# Altium schematic sheet Power_Internal.SchDoc
size A4; SheetNumber: 6
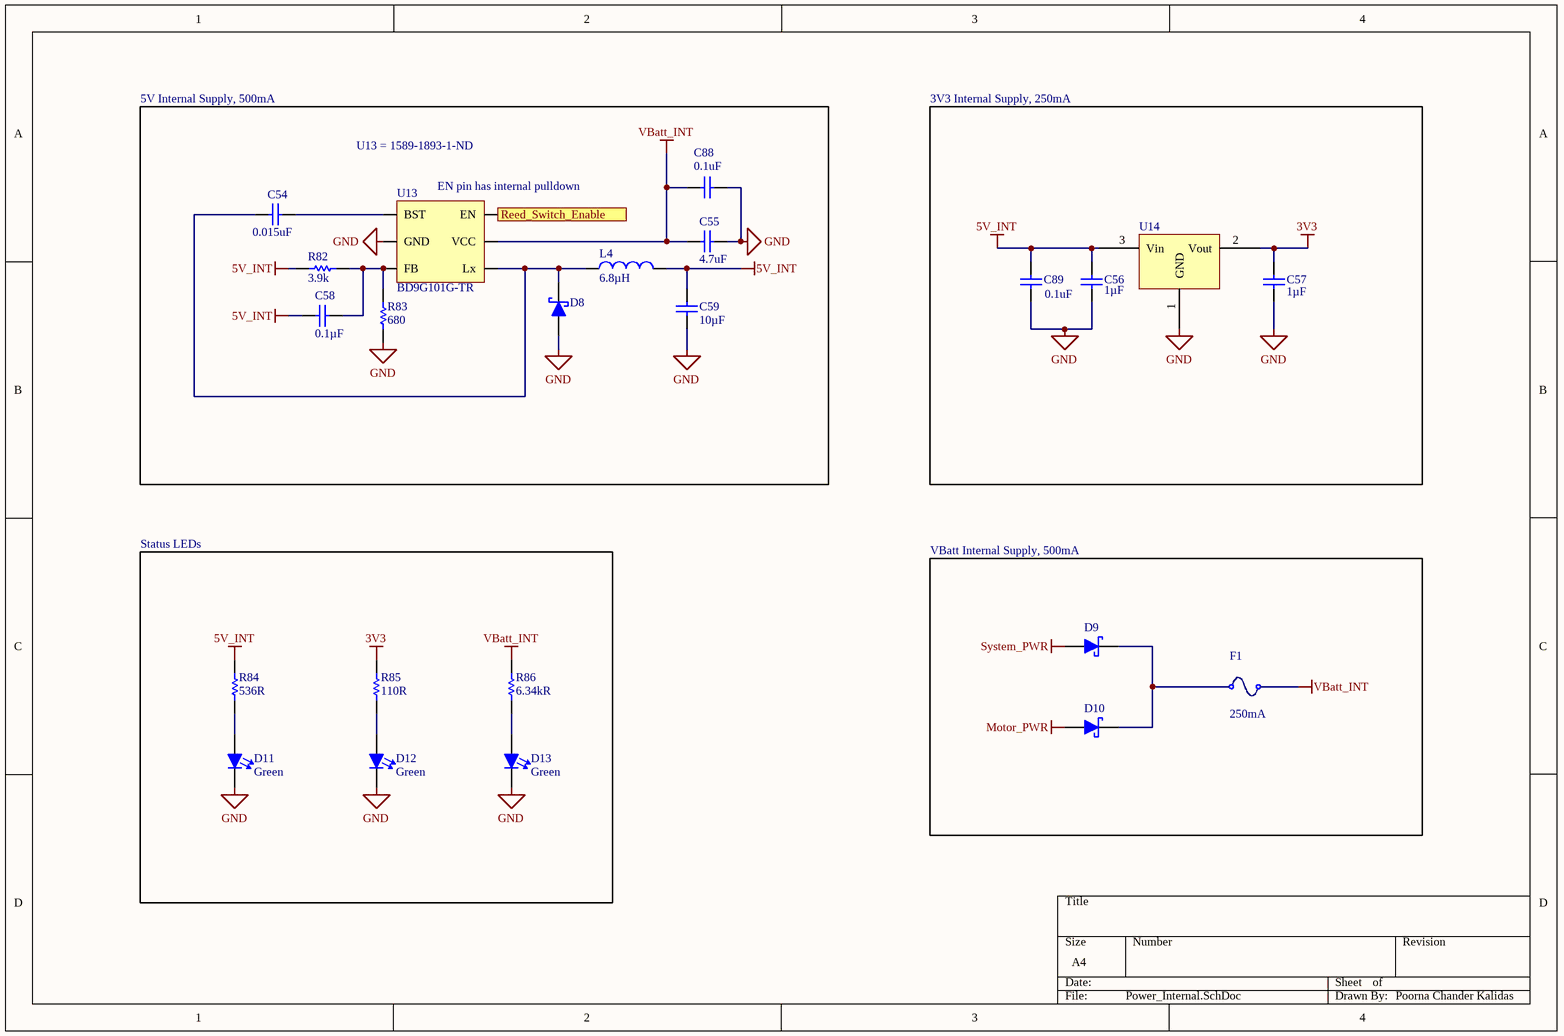
[diagram p0: Power_Internal.SchDoc]

## Parts
C54  value 0.015uF  [CAPC1608N(0603")]  (hidden comment: 0.015uF 50V 0603 SMD, Ceramic)
C55  value 4.7uF  [CAPC3216N(1206")]  (hidden comment: 4.7uF 50V 1206 SMD, Ceramic)
C56  value 1µF  [CAPC1608N(0603")]  (hidden comment: 1uF 25V 0603 SMD, Ceramic)
C57  value 1µF  [CAPC1608N(0603")]  (hidden comment: 1uF 25V 0603 SMD, Ceramic)
C58  Capacitance: 0.1µF  [CAPC1608N(0603")]  (hidden comment: 0.1uF, 50V, 10%, X7R, 1608)
C59  value 10µF  [CAPC2012N(0805")]  (hidden comment: 10uF 10V 0805 SMD, Ceramic)
C88  Capacitance: 0.1uF  [FP-CL10-0_1-IPC_A]  (hidden comment: CL10B104JB8NNNC)
C89  Capacitance: 0.1uF  [FP-CL10-0_1-IPC_A]  (hidden comment: CL10B104JB8NNNC)
D8  RB060M-60TR  [SOD-123]  (value not drawn)
D9  DSS14UTR  [SOD-123F]  (value not drawn)
D10  DSS14UTR  [SOD-123F]  (value not drawn)
D11  Color: Green  [FP-LB_Q39E-MFG]  (hidden comment: LT Q39G-Q1OO-25-1)
D12  Color: Green  [FP-LB_Q39E-MFG]  (hidden comment: LT Q39G-Q1OO-25-1)
D13  Color: Green  [FP-LB_Q39E-MFG]  (hidden comment: LT Q39G-Q1OO-25-1)
F1  Current: 250mA  [1206 SMD]  (hidden comment: SMD Fuse, 250mA, 63V, 1206)
L4  value 6.8µH  [NR4018T6R8M Inductor]  (hidden comment: NR4018T6R8M)
R82  value 3.9k  [RESC2012N(0805")]  (hidden comment: 3.9k, 5%, 1/8W, 0805 SMD)
R83  value 680  [RESC2012N(0805")]  (hidden comment: 680, 5%, 1/8W, 0805 SMD)
R84  Resistance: 536R  [RESC1608X55X30ML15T15]  (hidden comment: ERJ-3EKF5360V)
R85  Resistance: 110R  [RESC1608X55X25ML10T15]  (hidden comment: RC0603FR-07110RL)
R86  Resistance: 6.34kR  [RESC1609X50X30ML10T20]  (hidden comment: CRCW06036K34FKEA)
U13  BD9G101G-TR  [SOT23-6_N]
U14  3.3V 250mA Linear Reg LDO  [SOT95P245X110-3N]  (value not drawn)

## Blocks framed on the sheet
3V3 Internal Supply, 250mA: C56 C57 C89 U14
Status LEDs: D11-D13 R84-R86
VBatt Internal Supply, 500mA: D9 D10 F1

## Ports
Reed_Switch_Enable (in)

## Nets
3V3: C57.2(Cathode) R85.2 U14.2(Vout)
5V_INT: C56.2(Cathode) C58.1(Anode) C59.2(Cathode) C89.1 L4.2 R82.1 R84.1 U14.3(Vin)
GND: C55.1 C56.1(Anode) C57.1(Anode) C59.1(Anode) C88.2 C89.2 D8.A(Anode) D11.1(Cathode) D12.1(Cathode) D13.1(Cathode) R83.1 U13.2(GND) U14.1(GND)
Motor_PWR: D10.A(Anode)
System_PWR: D9.A(Anode)
VBatt_INT: C55.2 C88.1 F1.1 R86.2 U13.5(VCC)
Reed_Switch_Enable: U13.4(EN) ; port Reed_Switch_Enable
NetC54_1: C54.1 D8.K(Cathode) L4.1 U13.6(Lx)
NetC54_2: C54.2 U13.1(BST)
NetC58_2: C58.2(Cathode) R82.2 R83.2 U13.3(FB)
NetD9_K: D9.K(Cathode) D10.K(Cathode) F1.2
NetD11_2: D11.2(Anode) R84.2
NetD12_2: D12.2(Anode) R85.1
NetD13_2: D13.2(Anode) R86.1

## Notes on the sheet
- 5V Internal Supply, 500mA
- U13 = 1589-1893-1-ND
- (near U13) EN pin has internal pulldown
- Poorna Chander Kalidas

## Library data of the parts
C54 = CMP-006-0000-3: Capacitor, Ceramic, 50V, +/-10%, 0603 SMD, X7R; Created By: Lyden Smith; Created On: 2017-06-04; Design Item ID: 0.015uF 50V 0603 SMD, Ceramic; Component Type: Standard; Source: AUVic_Schematic_Library_Capacitors.SchLib; Pin Count: 2
C55 = CMP-006-0045-3: Capacitor, Ceramic, 50V, +/- 10%, 1206 SMD, X7R; Created By: Lyden Smith; Created On: 2017-06-04; Component Type: Standard; Pin Count: 2; Design Item ID: 4.7uF 50V 1206 SMD, Ceramic; Source: AUVic_Schematic_Library_Capacitors.SchLib
C56 C57 = CMP-006-0027-1: Capacitor, Ceramic, 25V, +/- 10%, 0603 SMD, X5R; MFG: Murata-Electronics-North-America; MFG#: GRM188R61E105KA12D; Created By: Andy Bates; Publisher: AUVic; Source: AUVic_Schematic_Library_Capacitors.SchLib; Component Type: Standard; Pin Count: 2; PackageDescription: Chip Capacitor; Design Item ID: 1uF 25V 0603 SMD, Ceramic; Published: 16-06-27
C58 = CMP-006-0008-1: CAP CER 0.1UF 50V 10% X7R 1608 (0603); Manufacturer: Samsung Electro-Mechanics America, Inc; Manufacturer Part Number: CL10B104KB8SFNC; RoHS: RoHS Compliant; Category: Capacitors; Stock 1: 743572; Pricing 1: 1=0.12, 10=0.033, 25=0.0232, 100=0.0152, 500=0.01064, 1000=0.00829 (CAD); Packaging: Cut Tape (CT); Tolerance: ±10%; Voltage - Rated: 50V; Temperature Coefficient: X7R; Mounting Type: Surface Mount, MLCC; Operating Temperature: -55°C ~ 125°C; Applications: Boardflex Sensitive; Ratings: -; Package / Case: 0603 (1608 Metric); Size / Dimension: 0.063" L x 0.031" W (1.60mm x 0.80mm); Height - Seated (Max): -; Thickness (Max): 0.035" (0.90mm); Lead Spacing: -; Features: Soft Termination; Lead Style: -; ComponentLink1URL: http://www.samsungsem.com/servlet/FileDownload?type=spec&file=CL10B104KB8SFNC.pdf; ComponentLink1Description: http://www.samsungsem.com/servlet/FileDownload?type=spec&file=CL10B104KB8SFNC.pdf; Design Item ID: 0.1uF, 50V, 10%, X7R, 1608; Component Type: Standard; Source: AUVic_Schematic_Library_Capacitors.SchLib; Pin Count: 2
C59 = CMP-006-0017-1: Capacitor, Ceramic, 10V, +/- 10%, 0805 SMD, X5R; Made By: Andy Bates; Published: 14-06-23; Publisher: AUVic; PackageDescription: Chip Capacitor; Source: AUVic_Schematic_Library_Capacitors.SchLib; Pin Count: 2; Design Item ID: 10uF 10V 0805 SMD, Ceramic; Component Type: Standard
C88 C89 = CMP-00000-4: CAP CER 0.1UF 50V X7R 0603; Material: Ceramic; Tolerance: 5%; Dielectric: X7R; Width: 0.031inch; Min Operating Temperature: -55°C; Contact Plating: Tin; Length: 1.6mm; Case/Package: 0603; Package Quantity: 1; Voltage Rating: 50V; Voltage: 50V; Radiation Hardening: No; Packaging: Tape and Reel; Max Operating Temperature: 125°C; Case Code (Imperial): 0603; Thickness: 0.035inch; Case Code (Metric): 1608; Height: 0.8mm; Mount: Surface Mount; Depth: 0.8mm
D8 = CMP-057-0013-1: Diode, Schottky, 60V, 2A; Created By: Lyden Smith; Date Created: 2017-06-02; Component Type: Standard; Design Item ID: RB060M-60TR; Pin Count: 2; Source: AUVic_Schematic_Library_Diodes.SchLib
D9 D10 = CMP-057-0003-1: Diode, Schottky, 40V, 1A; Source: AUVic_Schematic_Library_Diodes.SchLib; Date Created: 2018-07-11; Component Type: Standard; Design Item ID: DSS14UTR; ComponentLink1Description: Digikey; Pin Count: 2; Created By: Robert Keen; ComponentLink1URL: https://www.digikey.ca/product-detail/en/smc-diode-solutions/DSS14UTR/1655-1927-1-ND/8341869; Publisher: AUVic
D11-D13 = CMP-00064-3: LED GREEN DIFFUSED 0603 SMD; Dominant Wavelength: 530nm; Luminous Intensity: 280mcd; Lens Style: Diffused,Colorless,Rectangular; Number of LEDs: 1; Forward Voltage: 2.85V; Test Current: 5mA; Reverse Voltage: 5V; Forward Current: 15mA; Luminous Flux: 0.55lm; Radiation Hardening: No; Packaging: Tape and Reel; Mount: Surface Mount; Max Operating Temperature: 85°C; Number of Elements: 1; Number of Pins: 2; Min Operating Temperature: -40°C; Depth: 0.9mm; Case/Package: SMD/SMT; Length: 1.7mm
F1 = CMP-027-0003-1: Source: AUVic_Integrated_Library_Fuses.SchLib; Type: SMD; Date Created: 2018-02-05; Component Type: Standard; Created By: Lyden Smith; Design Item ID: SMD Fuse, 250mA, 63V, 1206; Pin Count: 2
L4 = CMP-029-0008-1: 6.8uH 1.06A; Created By: Lyden Smith; Created On: 2017-06-02; Pin Count: 2; Design Item ID: NR4018T6R8M; Component Type: Standard; Source: AUVic_Integrated_Library_Inductors.SchLib
R82 = CMP-047-0041-1: Created By: Lyden Smith; Created On: 2017-06-04; Pin Count: 2; Design Item ID: 3.9k, 5%, 1/8W, 0805 SMD; Component Type: Standard; Source: AUVic_Schematic_Library_Resistors.SchLib
R83 = CMP-047-0063-1: Created By: Lyden Smith; Created On: 2017-06-04; Pin Count: 2; Source: AUVic_Schematic_Library_Resistors.SchLib; Component Type: Standard; Design Item ID: 680, 5%, 1/8W, 0805 SMD
R84 = CMP-00071-2: SMD Chip Resistor, 0603 [1608 Metric], 536 ohm, ERJ3EK Series, 75 V, Thick Film, 100 mW; Tolerance: 1%; Voltage Rating (DC): 50V; Voltage Rating: 75V; Power Rating: 100mW; Temperature Coefficient: 100ppm/°C; Max Operating Temperature: 155°C; Package Quantity: 1; REACH SVHC: No SVHC; Depth: 0.8mm; Composition: Thick Film; Height: 0.022inch; Packaging: Tape and Reel; Contact Plating: Tin; Lead Free: Lead Free; Length: 1.6mm; Case/Package: 0603; Military Standard: Not; Features: Automotive AEC-Q200; Termination: SMD/SMT; Max Power Dissipation: 100mW; Width: 0.8mm; Mount: Surface Mount; Case Code (Metric): 1608; Case Code (Imperial): 0603; Number of Terminations: 2; Min Operating Temperature: -55°C
R85 = CMP-00069-2: RES SMD 110 OHM 1% 1/10W 0603; Max Power Dissipation: 100mW; Voltage Rating (DC): 50V; Temperature Coefficient: 100ppm/°C; Working Voltage: 75V; Military Standard: Not; Termination: SMD/SMT; Number of Terminations: 2; Features: Moisture Resistant; Min Operating Temperature: -55°C; Power Rating: 100mW; Height: 0.022inch; Package Quantity: 1; Lead Free: Lead Free; Tolerance: 1%; Voltage Rating: 50V; Composition: Thick Film; Case Code (Imperial): 0603; Length: 1.6mm; Packaging: Tape and Reel; Case Code (Metric): 1608; Max Operating Temperature: 155°C; Depth: 0.8mm; Case/Package: 0603; Width: 0.031inch
R86 = CMP-00072-2: VISHAY         CRCW06036K34FKEA.             SMD Chip Resistor, Thick Film, 6.34 kohm, 75 V, 0603 [1608 Metric], 100 mW,  1%, CRCW Series; Voltage Rating: 75V; Power Rating: 100mW; Temperature Coefficient: 100ppm/°C; Depth: 0.85mm; Military Standard: Not; Composition: Thick Film; Case Code (Metric): 1608; Case/Package: 0603; Packaging: Tape and Reel; Max Operating Temperature: 155°C; Tolerance: 1%; Height: 0.45mm; Package Quantity: 10; Case Code (Imperial): 0603; Width: 0.033inch; Length: 1.55mm; REACH SVHC: Unknown; Termination: SMD/SMT; Radiation Hardening: No; Contact Plating: Tin; Weight: 7.1E-05oz; Number of Pins: 2; Min Operating Temperature: -55°C; Features: Automotive AEC-Q200; Number of Terminations: 2; Max Power Dissipation: 100mW
U13 = CMP-045-0010-1: DC-DC Regulator, 6V-42V in, 1V-29.4V out, 500mA; Created on: 2017-06-02; Component Type: Standard; Pin Count: 6; Source: AUVic_Schematic_Library_Regulators.SchLib; Created by: Lyden Smith; Design Item ID: BD9G101G-TR
U14 = CMP-00003-1: IC REG LINEAR 3.3V 250MA SOT23-3; Max Input Voltage: 6.6V; Accuracy: 2%; Polarity: Positive; Number of Outputs: 1; Output Type: Fixed; Dropout Voltage: 400mV; Quiescent Current: 1uA; Min Input Voltage: 2.5V; Min Operating Temperature: -40°C; Supplier 1: Digi-Key; Supplier Part Number 1: AP2138N-3.3TRG1; Width: 1.7mm; Length: 3.02mm; Height: 1.3mm; Output Current: 250mA; Created By: Poorna Chander Kalidas; Number of Regulators: 1; Number of Pins: 3; Package Quantity: 3000; Date Created: June 26, 2020; Output Voltage: 3.3V; Max Operating Temperature: 85°C; Max Output Current: 250mA; Weight: 0.000282oz; Packaging: Tape and Reel; Lead Free: Lead Free; Mount: Surface Mount; Case/Package: SOT-23-3